# Altium schematic sheet LIN-INTERFACES.SchDoc: LIN Interfaces
size A4; Author: João Guimarães; Organization: Altium Limited; Address1: L3, 12a Rodborough Rd; Address2: Frenchs Forest; Address3: NSW; Address4: Australia 2086; Revision: 1.0; SheetNumber: 6; SheetTotal: 7
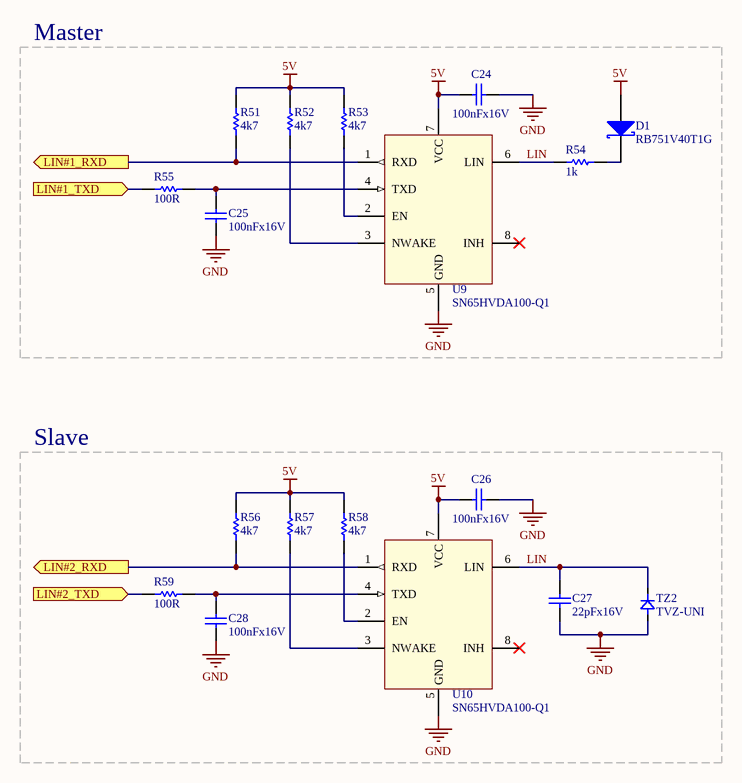
[diagram p0: LIN-INTERFACES.SchDoc]

## Parts
C24  100nFx16V  [DISC-0603]
C25  100nFx16V  [DISC-0603]
C26  100nFx16V  [DISC-0603]
C27  22pFx16V  [DISC-0603]
C28  100nFx16V  [DISC-0603]
D1  RB751V40T1G  [DISC-SOD-323]
R51  4k7  [DISC-0603]
R52  4k7  [DISC-0603]
R53  4k7  [DISC-0603]
R54  1k  [DISC-0603]
R55  100R  [DISC-0603]
R56  4k7  [DISC-0603]
R57  4k7  [DISC-0603]
R58  4k7  [DISC-0603]
R59  100R  [DISC-0603]
TZ2  TVZ-UNI  [DISC-SOD-323]
U9  SN65HVDA100-Q1  [CI-SOIC-8]
U10  SN65HVDA100-Q1  [CI-SOIC-8]

## Blocks framed on the sheet
Master: C24 C25 D1 R51-R55 U9
Slave: C26-C28 R56-R59 TZ2 U10

## Ports
LIN#1_RXD (out), LIN#1_TXD (in), LIN#2_RXD (out), LIN#2_TXD (in)

## Nets
5V: C24.2 C26.2 D1.1(A) R51.2 R52.2 R53.2 R56.2 R57.2 R58.2 U9.7(VCC) U10.7(VCC)
GND: C24.1 C25.1 C26.1 C27.1 C28.1 TZ2.1(A) U9.5(GND) U10.5(GND)
LIN: C27.2 R54.2 TZ2.2(C) U9.6(LIN) U10.6(LIN)
LIN#1_RXD: R51.1 U9.1(RXD) ; port LIN#1_RXD
LIN#1_TXD: R55.2 ; port LIN#1_TXD
LIN#2_RXD: R56.1 U10.1(RXD) ; port LIN#2_RXD
LIN#2_TXD: R59.2 ; port LIN#2_TXD
NetC25_2: C25.2 R55.1 U9.4(TXD)
NetC28_2: C28.2 R59.1 U10.4(TXD)
NetD1_2: D1.2(K) R54.1
NetR52_1: R52.1 U9.3(NWAKE)
NetR53_1: R53.1 U9.2(EN)
NetR57_1: R57.1 U10.3(NWAKE)
NetR58_1: R58.1 U10.2(EN)

Not connected (* = marked no-connect by the designer): U9 8(INH)*; U10 8(INH)*

## Notes on the sheet
- Title:
- Project:
- Date:
- Author:
- Version:
- Sheet:
- of

## Library data of the parts
C24-C26 C28 = Cap: Capacitor
C27 = Cap
D1 = D Schottky: Schottky Diode; Published: 8-Jun-2000; LatestRevisionDate: 17-Jul-2002; LatestRevisionNote: Re-released for DXP Platform.; PackageReference: SMB; Publisher: Altium Limited; PackageDescription: DO-214-AA/SMB; 2 C-Bend Leads; Body 5.3 x 3.6 mm, inc. leads (LxW); Code_JEDEC: DO-214-AA
R51-R59 = Res: Resistor
TZ2 = TVZ-Unidirectional
U9 U10 = SN65HVDA100-Q1: LIN Transceiver